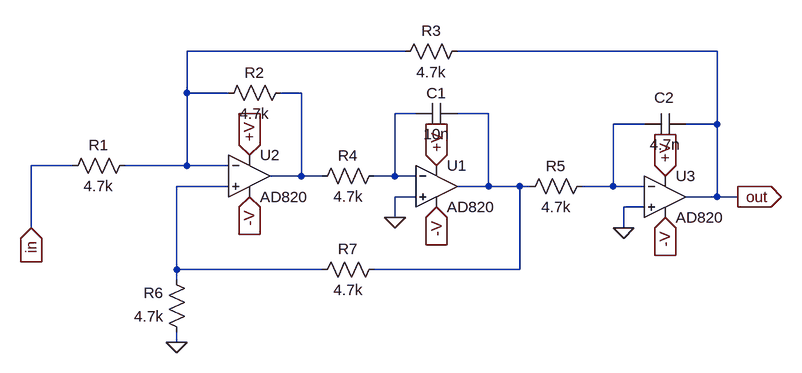
[diagram p0: schematic Low_pass_KHN_simbol.asc]
Low_pass_KHN_simbol.asc, the LTspice schematic file:
Version 4.1
SHEET 1 988 680
WIRE 384 -32 48 -32
WIRE 864 -32 464 -32
WIRE 48 32 48 -32
WIRE 112 32 48 32
WIRE 224 32 192 32
WIRE 400 64 368 64
WIRE 512 64 464 64
WIRE 752 80 704 80
WIRE 864 80 864 -32
WIRE 864 80 816 80
WIRE -128 144 -192 144
WIRE 48 144 48 32
WIRE 48 144 -48 144
WIRE 112 144 48 144
WIRE 224 160 224 32
WIRE 224 160 176 160
WIRE 256 160 224 160
WIRE 368 160 368 64
WIRE 368 160 336 160
WIRE 400 160 368 160
WIRE 112 176 32 176
WIRE 512 176 512 64
WIRE 512 176 464 176
WIRE 560 176 512 176
WIRE 576 176 560 176
WIRE 704 176 704 80
WIRE 704 176 656 176
WIRE 752 176 704 176
WIRE 400 192 368 192
WIRE 864 192 864 80
WIRE 864 192 816 192
WIRE 896 192 864 192
WIRE 752 208 720 208
WIRE 368 224 368 192
WIRE -192 240 -192 144
WIRE 720 240 720 208
WIRE 32 304 32 176
WIRE 256 304 32 304
WIRE 560 304 560 176
WIRE 560 304 336 304
WIRE 32 320 32 304
WIRE 32 416 32 400
FLAG 368 224 0
FLAG 720 240 0
FLAG 32 416 0
FLAG 144 192 -V
IOPIN 144 192 In
FLAG 432 208 -V
IOPIN 432 208 In
FLAG 784 224 -V
IOPIN 784 224 In
FLAG 144 128 +V
IOPIN 144 128 In
FLAG 432 144 +V
IOPIN 432 144 In
FLAG 784 160 +V
IOPIN 784 160 In
FLAG 896 192 out
IOPIN 896 192 Out
FLAG -192 240 in
IOPIN -192 240 In
SYMBOL res -32 128 R90
WINDOW 0 0 56 VBottom 2
WINDOW 3 32 56 VTop 2
SYMATTR InstName R1
SYMATTR Value 4.7k
SYMBOL res 208 16 R90
WINDOW 0 0 56 VBottom 2
WINDOW 3 32 56 VTop 2
SYMATTR InstName R2
SYMATTR Value 4.7k
SYMBOL res 480 -48 R90
WINDOW 0 0 56 VBottom 2
WINDOW 3 32 56 VTop 2
SYMATTR InstName R3
SYMATTR Value 4.7k
SYMBOL res 352 144 R90
WINDOW 0 0 56 VBottom 2
WINDOW 3 32 56 VTop 2
SYMATTR InstName R4
SYMATTR Value 4.7k
SYMBOL res 672 160 R90
WINDOW 0 0 56 VBottom 2
WINDOW 3 32 56 VTop 2
SYMATTR InstName R5
SYMATTR Value 4.7k
SYMBOL res 48 416 R180
WINDOW 0 36 76 Left 2
WINDOW 3 36 40 Left 2
SYMATTR InstName R6
SYMATTR Value 4.7k
SYMBOL res 352 288 R90
WINDOW 0 0 56 VBottom 2
WINDOW 3 32 56 VTop 2
SYMATTR InstName R7
SYMATTR Value 4.7k
SYMBOL cap 816 96 M270
WINDOW 0 41 33 VTop 2
WINDOW 3 0 32 VBottom 2
SYMATTR InstName C2
SYMATTR Value 4.7n
SYMBOL cap 464 80 M270
WINDOW 0 32 32 VTop 2
WINDOW 3 0 32 VBottom 2
SYMATTR InstName C1
SYMATTR Value 10n
SYMBOL OpAmps\\AD820 432 112 R0
SYMATTR InstName U1
SYMBOL OpAmps\\AD820 144 96 R0
SYMATTR InstName U2
SYMBOL OpAmps\\AD820 784 128 R0
SYMATTR InstName U3

The netlist it stands for:
* Low_pass_KHN_simbol.asc
R1 N001 in 4.7k
R2 N002 N001 4.7k
R3 out N001 4.7k
R4 N003 N002 4.7k
R5 N005 N004 4.7k
R6 0 N006 4.7k
R7 N004 N006 4.7k
C2 out N005 4.7n
C1 N004 N003 10n
X§U1 0 N003 +V -V N004 AD820  ; pins In+ In- V+ V- OUT
X§U2 N006 N001 +V -V N002 AD820  ; pins In+ In- V+ V- OUT
X§U3 0 N005 +V -V out AD820  ; pins In+ In- V+ V- OUT
.backanno
.end